# EAGLE design slouchpad_v1_leftpad (EAGLE 8.0.1)

## Sheet 1 of 2
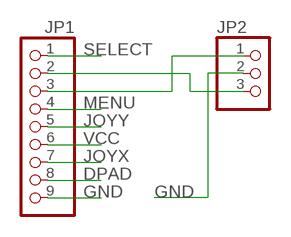
[diagram p0: schematic, sheet 1]

### Parts
JP1  PINHD-1X9  [1X09]
JP2  PINHD-1X3  [1X03]

### Nets
DPAD: JP1.8 ; also sheet 2
GND: JP1.9 JP2.2 ; also sheet 2
JOYX: JP1.7 ; also sheet 2
JOYY: JP1.5 ; also sheet 2
MENU: JP1.4 ; also sheet 2
N$1: JP1.2 JP2.3
N$2: JP1.3 JP2.1
SELECT: JP1.1 ; also sheet 2
VCC: JP1.6 ; also sheet 2

## Sheet 2 of 2
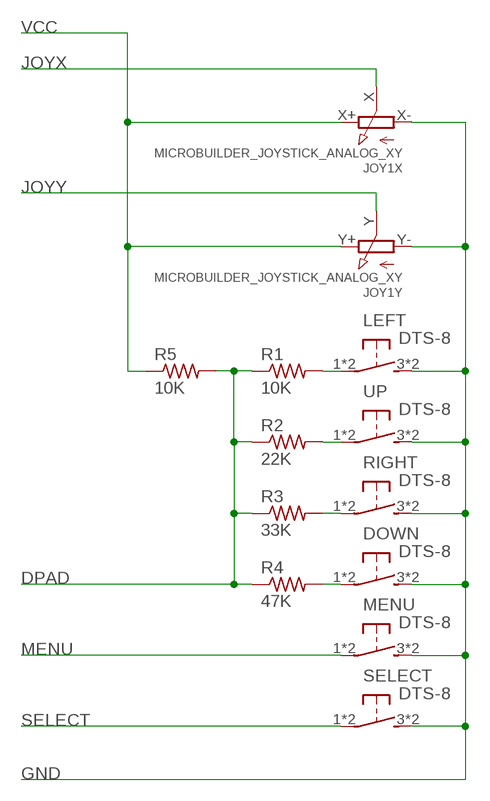
[diagram p1: schematic, sheet 2]

### Parts
DOWN  DTS-8  [DTS-8]
JOY1  MICROBUILDER_JOYSTICK_ANALOG_XY  [MICROBUILDER_JOYSTICK_ANALOG_MINITHM]
LEFT  DTS-8  [DTS-8]
MENU  DTS-8  [DTS-8]
R1  10K  R-US_0204/5  [0204/5]
R2  22K  R-US_0204/5  [0204/5]
R3  33K  R-US_0204/5  [0204/5]
R4  47K  R-US_0204/5  [0204/5]
R5  10K  R-US_0204/5  [0204/5]
RIGHT  DTS-8  [DTS-8]
SELECT  DTS-8  [DTS-8]
UP  DTS-8  [DTS-8]

### Nets
DPAD: R1.1 R2.1 R3.1 R4.1 R5.2 ; also sheet 1
GND: DOWN.3 DOWN.4 JOY1.X-(X:A) JOY1.Y-(Y:A) LEFT.3 LEFT.4 MENU.3 MENU.4 RIGHT.3 RIGHT.4 SELECT.3 SELECT.4 UP.3 UP.4 ; also sheet 1
JOYX: JOY1.X(X:S) ; also sheet 1
JOYY: JOY1.Y(Y:S) ; also sheet 1
MENU: MENU.1 MENU.2 ; also sheet 1
N$3: LEFT.1 LEFT.2 R1.2
N$4: R3.2 RIGHT.1 RIGHT.2
N$5: DOWN.1 DOWN.2 R4.2
N$6: R2.2 UP.1 UP.2
SELECT: SELECT.1 SELECT.2 ; also sheet 1
VCC: JOY1.X+(X:E) JOY1.Y+(Y:E) R5.1 ; also sheet 1

## Library data of the parts
DOWN LEFT MENU RIGHT SELECT UP = switch-tact:DTS-8
JOY1 = adafruit-minianalogthumb:MICROBUILDER_JOYSTICK_ANALOG_XY
JP1 = pinhead:PINHD-1X9: PIN HEADER
JP2 = pinhead:PINHD-1X3: PIN HEADER
R1-R5 = resistor:R-US_: RESISTOR, American symbol

## Board
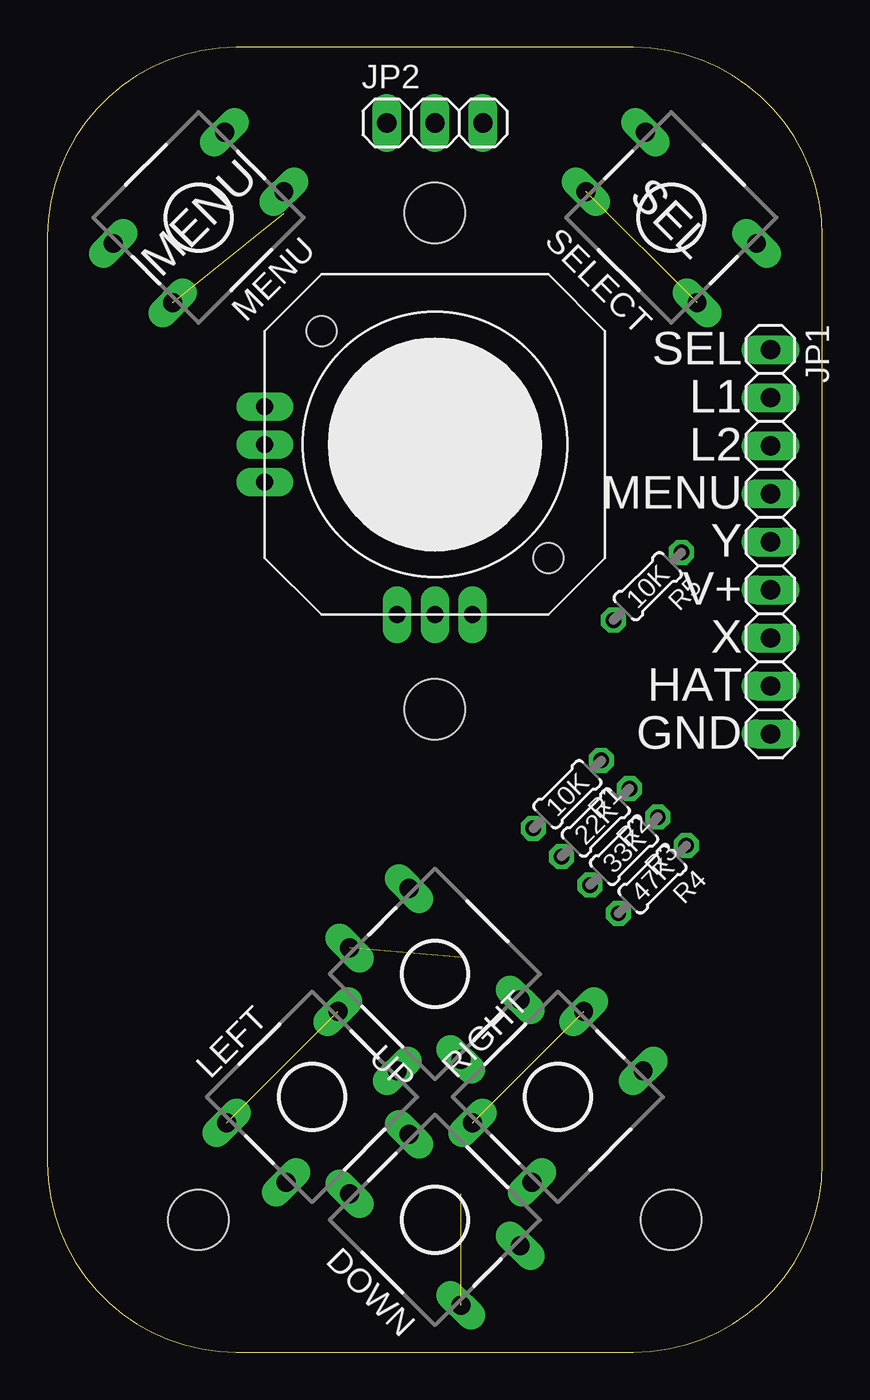
[diagram p2: board, top side]
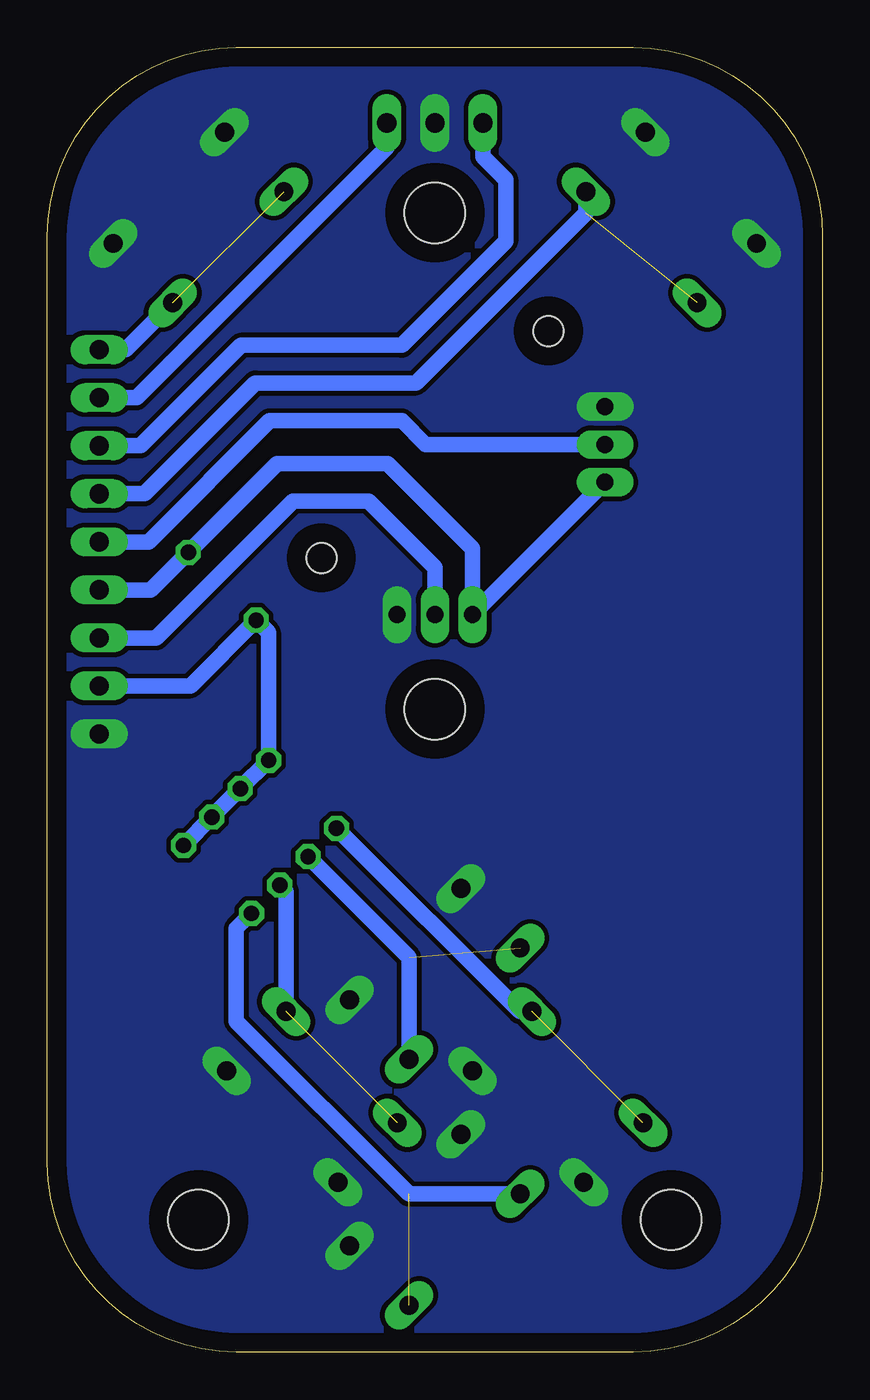
[diagram p3: board, bottom side, seen from below]

Size 41 x 69 mm. Coordinates in mm from the lower left corner, seen from the top.
Outline: 31,69 10,69 arc90 0,59 0,10 arc90 10,0 31,0 arc90 41,10 41,59 arc90 31,69
Copper layers (1*16): Top 0.035mm / dielectric 1.5mm / Bottom 0.035mm
Design rules "default *": minimum track width 10mil, minimum drill 24mil, track to track 10mil, track to pad 10mil, pad to pad 10mil, via to via 10mil, smd to smd 8mil, copper to edge 40mil, drill to drill 8mil, minimum pad ring 10mil, minimum via ring 8mil, stop-mask expansion 4mil, vias tented up to drill 0mil, thermal gap 10mil
Holes 3.2 mm at 8,7 33,7 20.5,34 20.5,60.25

### Footprints (pad centres in the part's own frame; a part is rotated, then mirrored left to right if it is on the bottom)
DTS-8 = drill 1 long: 1 -4.159,2.223; 2 4.159,2.223; 3 -4.159,-2.223; 4 4.159,-2.223
MICROBUILDER_JOYSTICK_ANALOG_MINITHM = drill 0.9 pad 1.5 long: X 0,9; X+ 2,9; X- -2,9; Y 9,0; Y+ 9,2; Y- 9,-2 | hole 1.6: -6,6; 6,-6
1X09 = drill 1.016 long: 1 -10.16,0; 2 -7.62,0; 3 -5.08,0; 4 -2.54,0; 5 0,0; 6 2.54,0; 7 5.08,0; 8 7.62,0; 9 10.16,0
1X03 = drill 1.016 long: 1 -2.54,0; 2 0,0; 3 2.54,0
0204/5 = drill 0.813 octagon: 1 -2.54,0; 2 2.54,0

### Placement (x,y rotation side)
DOWN  20.5,7 135 top
JOY1  20.5,48 180 top
JP1  38.25,42.85 270 top
JP2  20.5,65 0 top
LEFT  14,13.5 45 top
MENU  8,60 225 top
R1  27.5,29.5 225 top
R2  29,28 225 top
R3  30.5,26.5 225 top
R4  32,25 225 top
R5  31.75,40.5 225 top
RIGHT  27,13.5 45 top
SELECT  33,60 135 top
UP  20.5,20 135 top

### Tracks (layer width: path | path; a pad name or v marks a point on that pad's centre or on a via)
DPAD
  Bottom 0.813: JP1.8 33.43,35.23 R5.2 29.3,38.05 R1.1 R2.1 R3.1 R4.1
GND
  pour Bottom (no thermals): 41,59 41,10 arc-90 31,0 10,0 arc-90 0,10 0,59 arc-90 10,69 31,69 arc-90
JOYX
  Bottom 0.813: JP1.7 35.23,37.77 28,45 24,45 20.5,41.5 JOY1.X
JOYY
  Bottom 0.813: JP1.5 35.65,42.85 29.25,49.25 22.25,49.25 21,48 JOY1.Y
MENU  (1 unrouted)
  Bottom 0.813: JP1.4 35.86,45.39 30,51.25 21.5,51.25 12.51,60.24 MENU.1
N$1
  Bottom 0.813: JP2.3 23.04,63.71 36.28,50.47 JP1.2
N$2
  Bottom 0.813: JP1.3 36.07,47.93 30.75,53.25 22.25,53.25 16.75,58.75 16.75,62 17.96,63.21 JP2.1
N$3  (1 unrouted)
  Bottom 0.813: LEFT.2 16.01,18.01 R1.2
N$4  (1 unrouted)
  Bottom 0.813: R3.2 28.37,24.37 RIGHT.2
N$5  (1 unrouted)
  Bottom 0.813: DOWN.2 21.87,8.37 31,17.5 31,22.41 R4.2
N$6  (1 unrouted)
  Bottom 0.813: R2.2 21.87,20.87 UP.1
SELECT  (1 unrouted)
  Bottom 0.813: SELECT.1 36.85,53.01 JP1.1
VCC
  Bottom 0.813: JOY1.Y+ JOY1.X+ 18.5,42.5 23,47 28.84,47 R5.1 35.53,40.31 JP1.6

### Text on the board
tSilk: MENU | SEL | SEL | L1 | L2 | MENU | Y | V+ | 10K | X | HAT | GND | 10K | 22K | 33K | 47K